# EAGLE schematic OpenHealth (EAGLE 7.2.0)
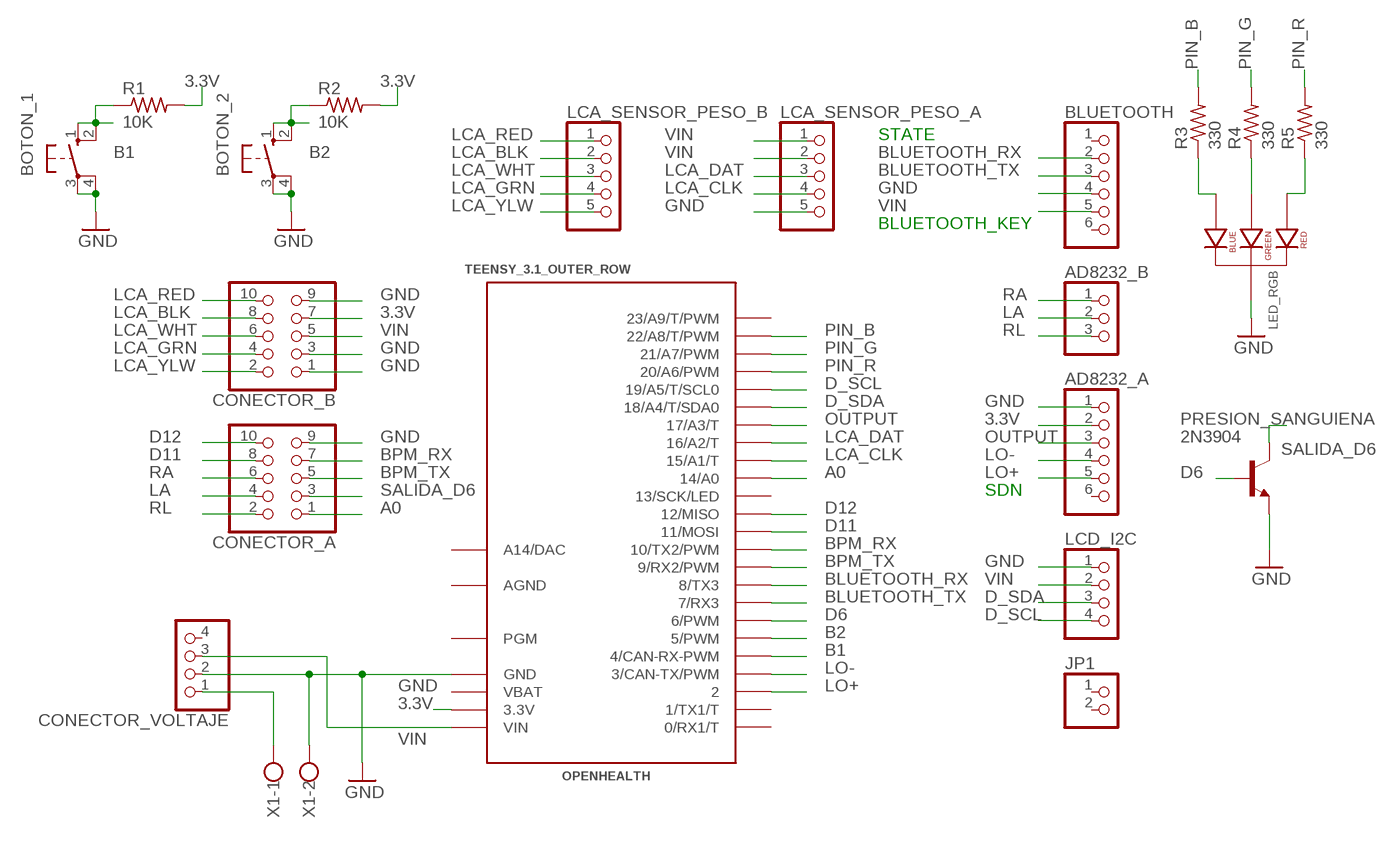
[diagram p0: schematic, sheet 1]

## Parts
AD8232_A  PINHD-1X6  [1X06]
AD8232_B  PINHD-1X3  [1X03]
BLUETOOTH  PINHD-1X6  [1X06]
BOTON_1  10-XX  [B3F-10XX]
BOTON_2  10-XX  [B3F-10XX]
CONECTOR_A  PINHD-2X5  [2X05]
CONECTOR_B  PINHD-2X5  [2X05]
CONECTOR_VOLTAJE  PINHD-1X4  [1X04]
JP1  PINHD-1X2  [1X02]
LCA_SENSOR_PESO_A  PINHD-1X5  [1X05]
LCA_SENSOR_PESO_B  PINHD-1X5  [1X05]
LCD_I2C  PINHD-1X4  [1X04]
LED_RGB  LED-RGB-CC-THRUCLEAR  [LED-RGB-THRU]
OPENHEALTH  TEENSY_3.1_OUTER_ROW  [TEENSY3-OUTER_ROW]
PRESION_SANGUIENA  2N3904  [TO92]
R1  10K  R-US_0204/7  [0204/7]
R2  10K  R-US_0204/7  [0204/7]
R3  330  R-US_0204/7  [0204/7]
R4  330  R-US_0204/7  [0204/7]
R5  330  R-US_0204/7  [0204/7]
X1  W237-102  [W237-102]

## Nets
3.3V: AD8232_A.2 CONECTOR_B.7 OPENHEALTH.3.3V OPENHEALTH.3.3V1(3.3V) R1.2 R2.2
A0: CONECTOR_A.1 OPENHEALTH.14/A0
B1: BOTON_1.1(S) BOTON_1.2(S1) OPENHEALTH.4(4/CAN-RX-PWM) R1.1
B2: BOTON_2.1(S) BOTON_2.2(S1) OPENHEALTH.5(5/PWM) R2.1
BLUETOOTH_RX: BLUETOOTH.2 OPENHEALTH.8(8/TX3)
BLUETOOTH_TX: BLUETOOTH.3 OPENHEALTH.7(7/RX3)
BPM_RX: CONECTOR_A.7 OPENHEALTH.10(10/TX2/PWM)
BPM_TX: CONECTOR_A.5 OPENHEALTH.9(9/RX2/PWM)
D6: OPENHEALTH.6(6/PWM) PRESION_SANGUIENA.2(B)
D11: CONECTOR_A.8 OPENHEALTH.11(11/MOSI)
D12: CONECTOR_A.10 OPENHEALTH.12(12/MISO)
D_SCL: LCD_I2C.4 OPENHEALTH.19/A5(19/A5/T/SCL0)
D_SDA: LCD_I2C.3 OPENHEALTH.18/A4(18/A4/T/SDA0)
GND: AD8232_A.1 BLUETOOTH.4 BOTON_1.3(P) BOTON_1.4(P1) BOTON_2.3(P) BOTON_2.4(P1) CONECTOR_A.9 CONECTOR_B.1 CONECTOR_B.3 CONECTOR_B.9 CONECTOR_VOLTAJE.2 LCA_SENSOR_PESO_A.5 LCD_I2C.1 LED_RGB.2(CATHODE) OPENHEALTH.GND OPENHEALTH.GND1(GND) PRESION_SANGUIENA.3(E) X1.2
LA: AD8232_B.2 CONECTOR_A.4
LCA_BLK: CONECTOR_B.8 LCA_SENSOR_PESO_B.2
LCA_CLK: LCA_SENSOR_PESO_A.4 OPENHEALTH.15/A1(15/A1/T)
LCA_DAT: LCA_SENSOR_PESO_A.3 OPENHEALTH.16/A2(16/A2/T)
LCA_GRN: CONECTOR_B.4 LCA_SENSOR_PESO_B.4
LCA_RED: CONECTOR_B.10 LCA_SENSOR_PESO_B.1
LCA_WHT: CONECTOR_B.6 LCA_SENSOR_PESO_B.3
LCA_YLW: CONECTOR_B.2 LCA_SENSOR_PESO_B.5
LO+: AD8232_A.5 OPENHEALTH.2
LO-: AD8232_A.4 OPENHEALTH.3(3/CAN-TX/PWM)
N$1: CONECTOR_VOLTAJE.1 X1.1
N$2: LED_RGB.4(BLUE_CATHODE) R3.1
N$3: LED_RGB.1(RED_CATHODE) R5.1
N$4: LED_RGB.3(GREEN_CATHODE) R4.1
OUTPUT: AD8232_A.3 OPENHEALTH.17/A3(17/A3/T)
PIN_B: OPENHEALTH.22/A8(22/A8/T/PWM) R3.2
PIN_G: OPENHEALTH.21/A7(21/A7/PWM) R4.2
PIN_R: OPENHEALTH.20/A6(20/A6/PWM) R5.2
RA: AD8232_B.1 CONECTOR_A.6
RL: AD8232_B.3 CONECTOR_A.2
SALIDA_D6: CONECTOR_A.3 PRESION_SANGUIENA.1(C)
VIN: BLUETOOTH.5 CONECTOR_B.5 CONECTOR_VOLTAJE.3 LCA_SENSOR_PESO_A.1 LCA_SENSOR_PESO_A.2 LCD_I2C.2 OPENHEALTH.VIN
Unconnected: AD8232_A.6 BLUETOOTH.1 BLUETOOTH.6 CONECTOR_VOLTAJE.4 JP1.1 JP1.2 OPENHEALTH.0(0/RX1/T) OPENHEALTH.1(1/TX1/T) OPENHEALTH.13(13/SCK/LED) OPENHEALTH.23/A9(23/A9/T/PWM) OPENHEALTH.PGM OPENHEALTH.RESET/DAC(A14/DAC)

## Notes on the sheet
- STATE
- BLUETOOTH_KEY
- SDN

## Power pins joined to a net without a drawn wire
AGND: OPENHEALTH.AGND
VBAT: OPENHEALTH.VBAT

## Library data of the parts
AD8232_A BLUETOOTH = pinhead:PINHD-1X6: PIN HEADER
AD8232_B = pinhead:PINHD-1X3: PIN HEADER
BOTON_1 BOTON_2 = switch-omron:10-XX: OMRON SWITCH; MPN: B3F-1000; OC_FARNELL: 176432; OC_NEWARK: 36M3542
CONECTOR_A CONECTOR_B = pinhead:PINHD-2X5: PIN HEADER
CONECTOR_VOLTAJE LCD_I2C = pinhead:PINHD-1X4: PIN HEADER
JP1 = pinhead:PINHD-1X2: PIN HEADER
LCA_SENSOR_PESO_A LCA_SENSOR_PESO_B = pinhead:PINHD-1X5: PIN HEADER
LED_RGB = SparkFun-LED:LED-RGB-CC-THRU: RGB Through-hole common cathode LED SparkFun Storefront: COM-00105 (Clear) COM-09264 (Diffuse); PROD_ID: DIO-08418
OPENHEALTH = Teensy_3_and_LC_Series_Boards_v1.1:TEENSY_3.1_OUTER_ROW: Footprint for Teensy 3.1 or 3.2 board using all pin connections on the outer perimeter
PRESION_SANGUIENA = transistor:2N3904: NPN TRANSISTOR
R1-R5 = resistor:R-US_: RESISTOR, American symbol
X1 = con-wago-500:W237-102: WAGO SCREW CLAMP; MPN: 237-102; OC_FARNELL: unknown; OC_NEWARK: 70K9898